# EAGLE design DOT-SHIM (EAGLE 9.6.2)
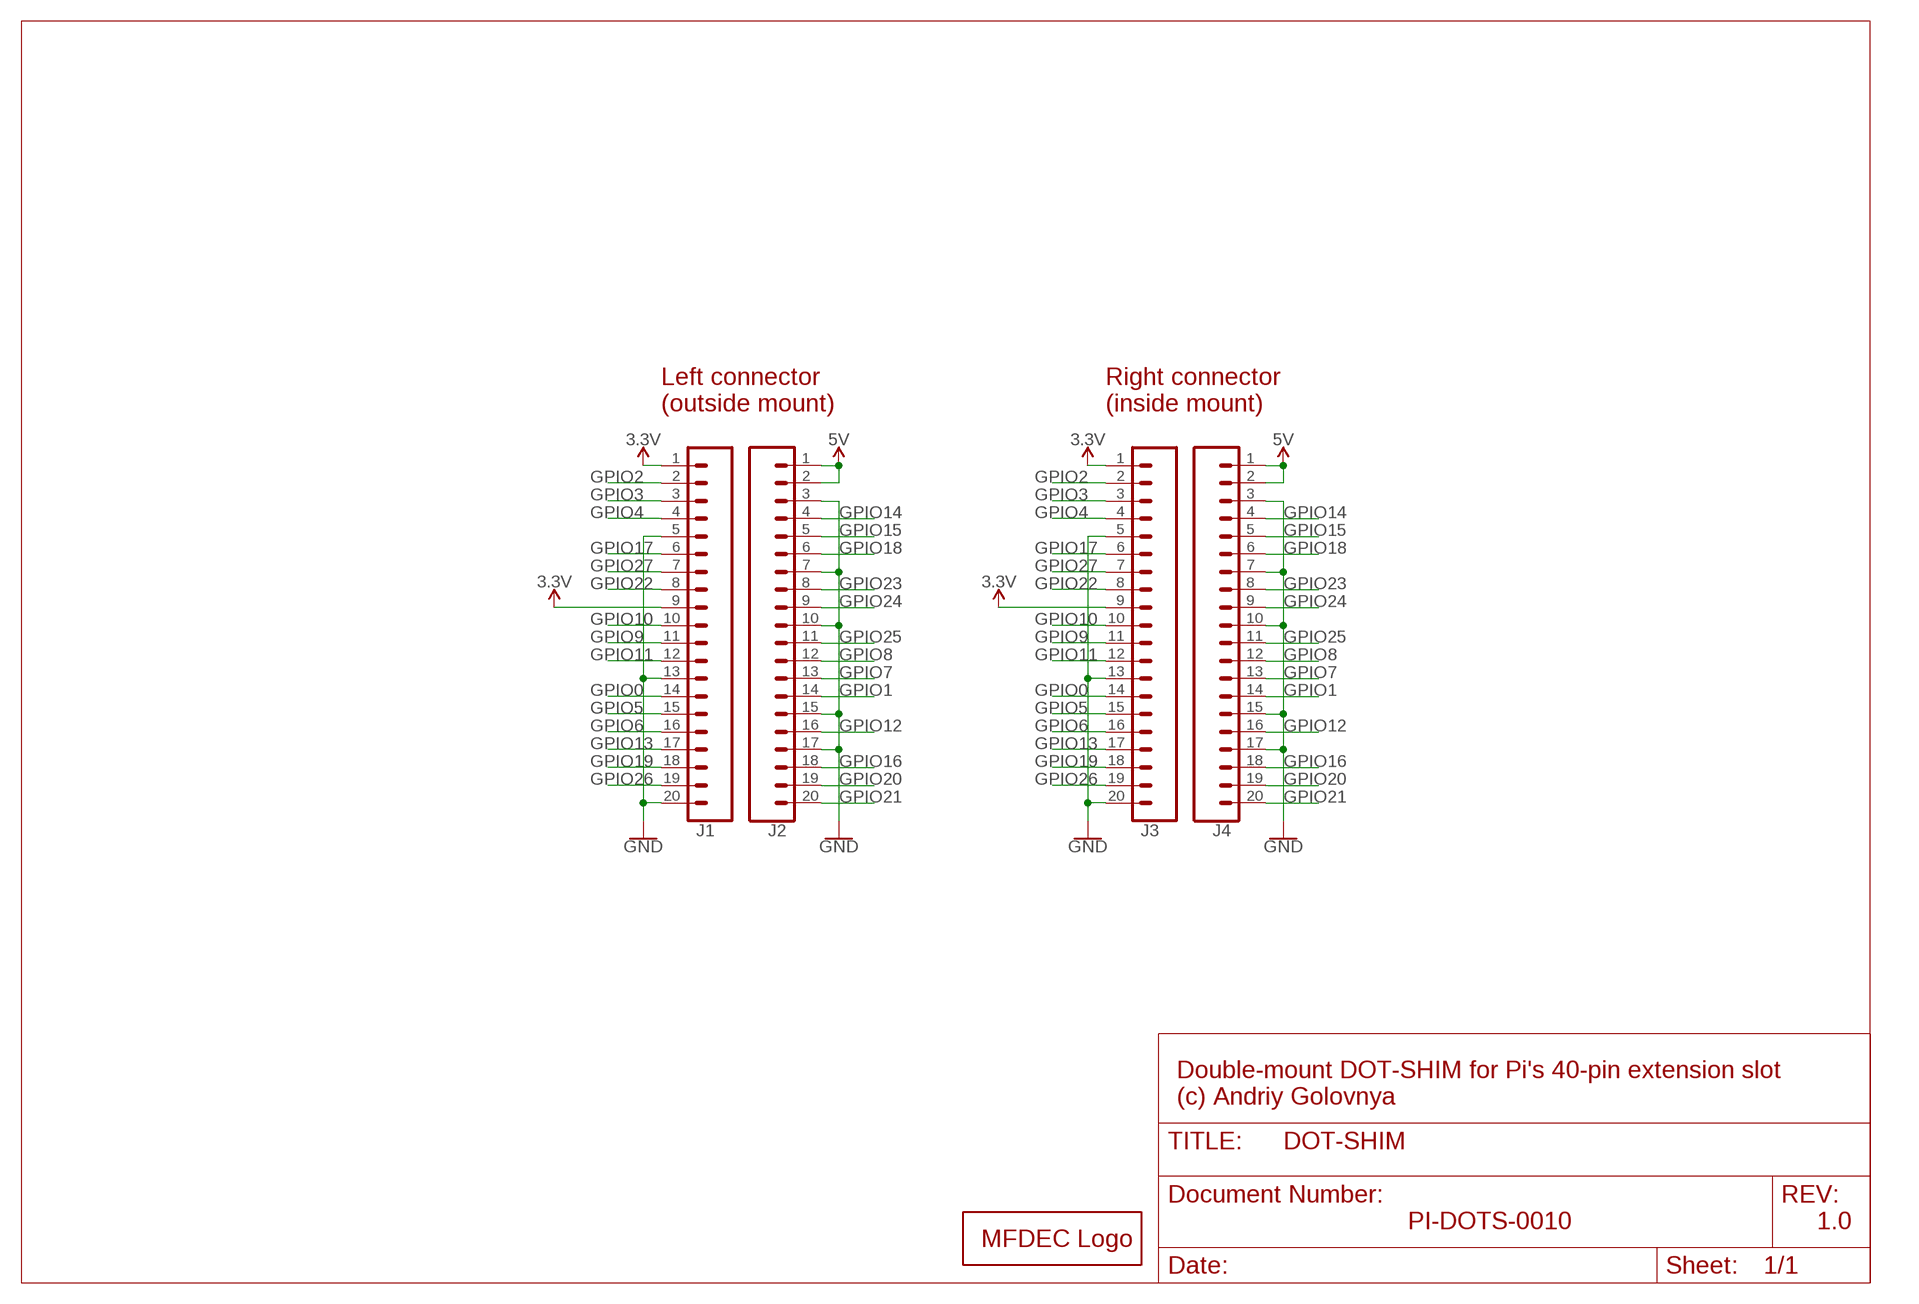
[diagram p0: schematic, sheet 1]

## Parts
J1  CONN_20LOCK  [1X20_LOCK]
J2  CONN_20LOCK  [1X20_LOCK]
J3  CONN_20LOCK  [1X20_LOCK]
J4  CONN_20LOCK  [1X20_LOCK]
LOGO2  MFDECLOGO_L_20MM  [MFDEC_L_20MM]

## Nets
3.3V: J1.1 J1.9 J3.1 J3.9
5V: J2.1 J2.2 J4.1 J4.2
GND: J1.5 J1.13 J1.20 J2.3 J2.7 J2.10 J2.15 J2.17 J3.5 J3.13 J3.20 J4.3 J4.7 J4.10 J4.15 J4.17
GPIO0: J1.14 J3.14
GPIO1: J2.14 J4.14
GPIO2: J1.2 J3.2
GPIO3: J1.3 J3.3
GPIO4: J1.4 J3.4
GPIO5: J1.15 J3.15
GPIO6: J1.16 J3.16
GPIO7: J2.13 J4.13
GPIO8: J2.12 J4.12
GPIO9: J1.11 J3.11
GPIO10: J1.10 J3.10
GPIO11: J1.12 J3.12
GPIO12: J2.16 J4.16
GPIO13: J1.17 J3.17
GPIO14: J2.4 J4.4
GPIO15: J2.5 J4.5
GPIO16: J2.18 J4.18
GPIO17: J1.6 J3.6
GPIO18: J2.6 J4.6
GPIO19: J1.18 J3.18
GPIO20: J2.19 J4.19
GPIO21: J2.20 J4.20
GPIO22: J1.8 J3.8
GPIO23: J2.8 J4.8
GPIO24: J2.9 J4.9
GPIO25: J2.11 J4.11
GPIO26: J1.19 J3.19
GPIO27: J1.7 J3.7

## Notes on the sheet
- Left connector
  (outside mount)
- Right connector
  (inside mount)
- Double-mount DOT-SHIM for Pi's 40-pin extension slot
  (c) Andriy Golovnya
- PI-DOTS-0010 | 1.0

## Library data of the parts
J1-J4 = _my_locked_connectors:CONN_20: Multi connection point. Often used as Generic Header-pin footprint for 0.1 inch spaced/style header connections On any of the 0.1 inch spaced packages, you can populate with these: Break Away Headers - Straight <https://www.sparkfun.com/products/116> (PRT-00116) Break Away Male Headers - Right Angle <https://www.sparkfun.com/products/553> (PRT-00553) Female Headers <https://www.sparkfun.com/products/115> (PRT-00115) Break Away Headers - Machine Pin <https://www.sparkfun.com/products/117> (PRT-00117) Break Away Female Headers - Swiss Machine Pin <https://www.sparkfun.com/products/743> (PRT-00743) For SCREWTERMINALS and SPRING TERMINALS visit here: Screw Terimnals on SparkFun.com <https://www.sparkfun.com/search/results?term=Screw+Terminals> (5mm/3.5mm/2.54mm spacing) This device is also useful as a general connection point to wire up your design to another part of your project. Our various solder wires solder well into these plated through hole pads. Hook-Up Wire - Assortment (Stranded, 22 AWG) <https://www.sparkfun.com/products/11375> (PRT-11375) Hook-Up Wire - Assortment (Solid Core, 22 AWG) <https://www.sparkfun.com/products/11367> (PRT-11367) View the entire wire category on our website here <https://www.sparkfun.com/categories/141> Special notes: Molex polarized connector foot print use with SKU : PRT-08231 with associated crimp pins and housings. 1MM SMD Version SKU: PRT-10208 NOTES ON THE VARIANTS LOCK and LOCK_LONGPADS... This footprint was designed to help hold the alignment of a through-hole component (i.e. 6-pin header) while soldering it into place. You may notice that each hole has been shifted either up or down by 0.005 of an inch from it's more standard position (which is a perfectly straight line). This slight alteration caused the pins (the squares in the middle) to touch the edges of the holes. Because they are alternating, it causes a "brace" to hold the component in place. 0.005 has proven to be the perfect amount of "off-center" position when using our standard breakaway headers. Although looks a little odd when you look at the bare footprint, once you have a header in there, the alteration is very hard to notice. Also,if you push a header all the way into place, it is covered up entirely on the bottom side. Note about LOCK SPECIAL package: This is just like the LOCK variant in that the holes are staggared by 5 mil, but except for the last two holes. They are not altered from the "standard" footprint layout. This is used for a special purpose on the layout of our Graphic LCD Backpack. Make sure you want to use this device before selecting it for you project!
LOGO2 = _my_logos:MFDECLOGO: Midnight Fog - Digital Eye Candy LOGO

## Board
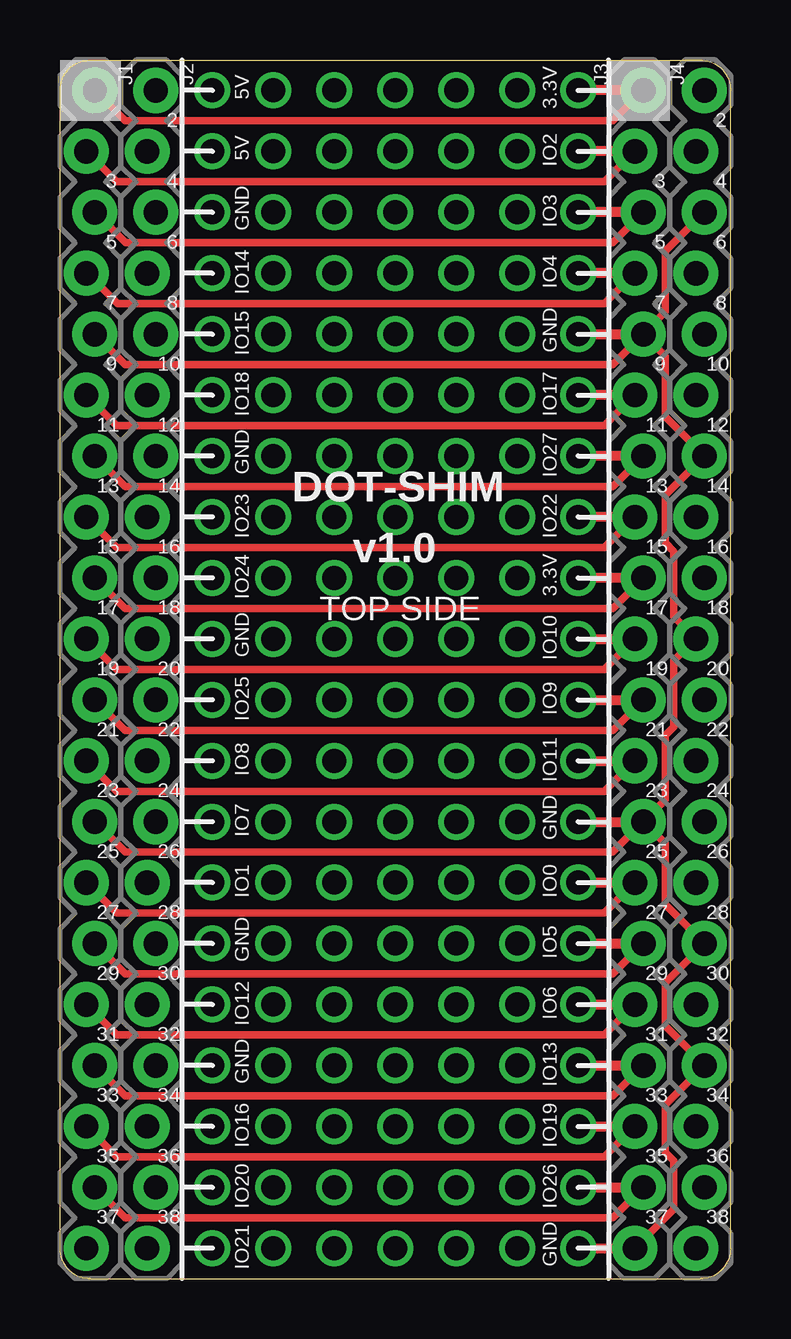
[diagram p1: board, top side]
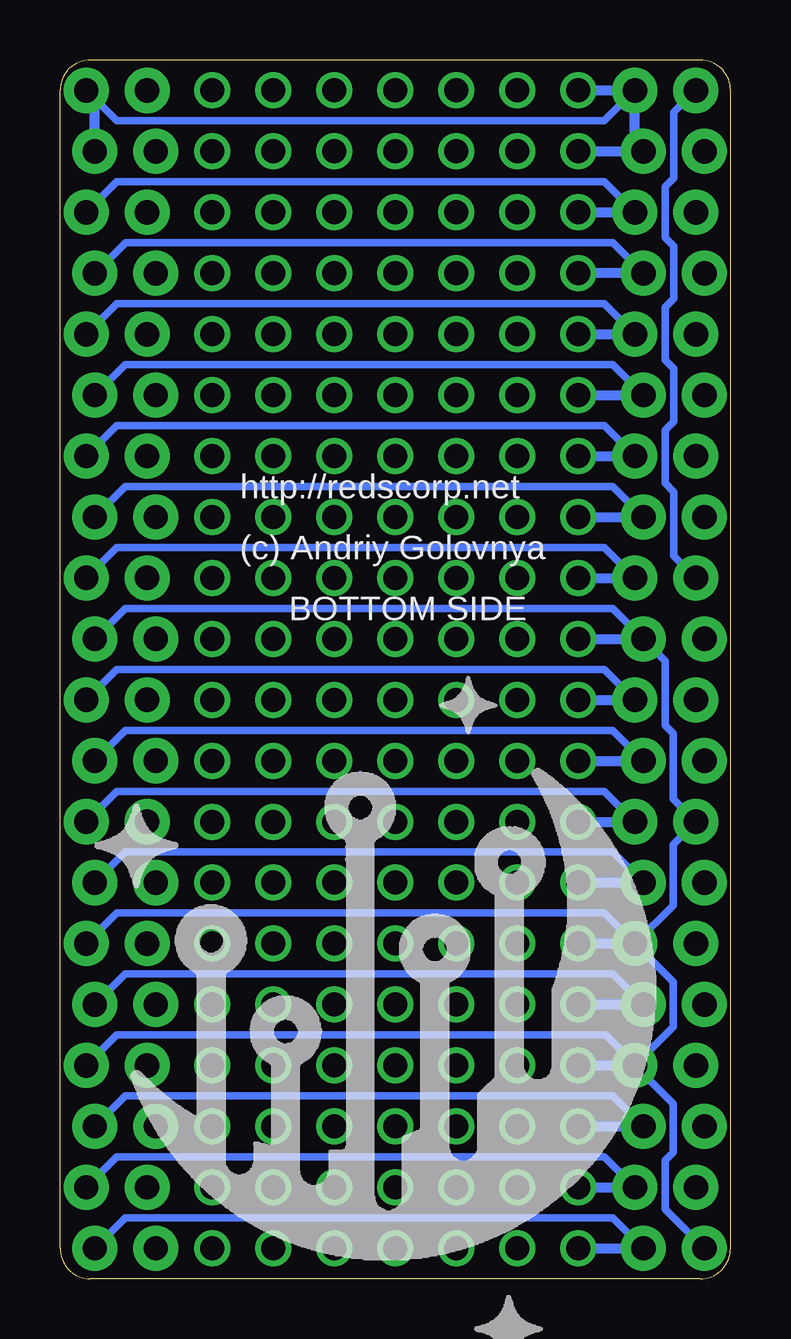
[diagram p2: board, bottom side, seen from below]

Size 27.94 x 50.8 mm. Coordinates in mm from the lower left corner, seen from the top.
Outline: 1.27,0 26.67,0 arc90 27.94,1.27 27.94,49.53 arc90 26.67,50.8 1.27,50.8 arc90 0,49.53 0,1.27 arc90 1.27,0
Copper layers (1*16): Top 0.035mm / dielectric 1.5mm / Bottom 0.035mm
Design rules "default *": minimum track width 6mil, minimum drill 0.35mm, track to track 6mil, track to pad 6mil, pad to pad 6mil, via to via 6mil, smd to smd 6mil, copper to edge 6mil, drill to drill 6mil, minimum pad ring 10mil, minimum via ring 8mil, stop-mask expansion 4mil, vias tented up to drill 20mil, thermal gap 10mil

### Footprints (pad centres in the part's own frame; a part is rotated, then mirrored left to right if it is on the bottom)
1X20_LOCK = drill 1.016 pad 1.88: 1 0,0.178; 2 2.54,-0.178; 3 5.08,0.178; 4 7.62,-0.178; 5 10.16,0.178; 6 12.7,-0.178; 7 15.24,0.178; 8 17.78,-0.178; 9 20.32,0.178; 10 22.86,-0.178; 11 25.4,0.178; 12 27.94,-0.178; 13 30.48,0.178; 14 33.02,-0.178; 15 35.56,0.178; 16 38.1,-0.178; 17 40.64,0.178; 18 43.18,-0.178; 19 45.72,0.178; 20 48.26,-0.178

### Placement (x,y rotation side)
J1  1.27,49.53 270 top
J2  3.81,49.53 270 top
J3  24.13,49.53 270 top
J4  26.67,49.53 270 top
LOGO2  1.27,-5.08 90 bottom  (outside the outline)

### Tracks (layer width: path | path; a pad name or v marks a point on that pad's centre or on a via)
3.3V  (via drill 1)
  Top 0.305: J1.1 2.72,48.26 23.04,48.26 J3.1 | J1.9 2.72,27.94 23.04,27.94 J3.9
  Top 0.406: J3.1 v21.59,49.53 | J3.9 v21.59,29.21
  Bottom 0.305: J1.1 2.36,48.62 2.36,45.88 2.72,45.52 2.72,43.39 2.36,43.03 2.36,40.85 2.72,40.49 2.72,38.28 2.36,37.93 2.36,35.72 2.72,35.36 2.72,33.16 2.36,32.8 2.36,30.12 J1.9
5V  (via drill 1)
  Bottom 0.305: J4.1 25.58,48.26 5.26,48.26 J2.1
  Bottom 0.406: v6.35,49.53 J2.1 3.99,47.35 J2.2 v6.35,46.99 | J4.2 26.49,49.17 J4.1
GND  (via drill 1)
  Top 0.305: J1.5 2.72,38.1 23.04,38.1 J3.5 | J1.13 2.72,17.78 23.04,17.78 J3.13 | J3.20 25.58,2.9 25.58,4.92 25.22,5.28 25.22,7.25 26.85,8.87 J4.17 26.85,8.91 25.22,10.53 25.22,12.33 26.85,13.95 J4.15 25.22,15.6 25.22,18.14 J3.13 | J3.13 25.22,19.96 25.22,22.64 25.58,23 25.58,25.76 J4.10 26.49,26.69 25.58,27.6 25.58,30.32 25.22,30.68 25.22,32.66 J4.7 26.85,34.31 25.22,35.93 25.22,38.46 J3.5 | J3.5 24.31,39.39 25.22,40.3 25.22,42.82 J4.3
  Top 0.406: v21.59,39.37 J3.5 | v21.59,19.05 J3.13 | v21.59,1.27 J3.20
  Bottom 0.305: J4.3 25.58,45.72 5.26,45.72 J2.3 | J1.20 2.72,2.9 2.72,4.95 2.39,5.28 2.39,7.29 J2.17 | J2.17 2.39,10.49 2.39,12.37 J2.15 5.26,15.24 25.58,15.24 J4.15 | 3.96,13.99 2.39,15.57 2.39,18.11 J1.13 2.39,19.99 2.39,22.73 2.72,23.06 2.72,25.76 J2.10 4.9,27.94 25.22,27.94 J4.10 | J2.7 5.26,35.56 25.58,35.56 J4.7 | J2.17 3.99,8.94 5.21,10.16 25.58,10.16 J4.17
  Bottom 0.406: v6.35,44.45 J2.3 | v6.35,34.29 J2.7 | v6.35,26.67 J2.10 | v6.35,13.97 J2.15 3.96,13.99 | v6.35,8.89 J2.17
GPIO0  (via drill 1)
  Top 0.305: J1.14 2.36,15.24 22.68,15.24 J3.14
  Top 0.406: v21.59,16.51 J3.14
GPIO1  (via drill 1)
  Bottom 0.305: J2.14 4.9,17.78 25.22,17.78 J4.14
  Bottom 0.406: v6.35,16.51 J2.14
GPIO2  (via drill 1)
  Top 0.305: J1.2 2.36,45.72 22.68,45.72 J3.2
  Top 0.406: J3.2 v21.59,46.99
GPIO3  (via drill 1)
  Top 0.305: J1.3 1.47,44.45 2.74,43.18 23.04,43.18 J3.3
  Top 0.406: J3.3 v21.59,44.45
GPIO4  (via drill 1)
  Top 0.305: J1.4 1.14,41.91 2.41,40.64 22.68,40.64 J3.4
  Top 0.406: J3.4 v21.59,41.91
GPIO5  (via drill 1)
  Top 0.305: J1.15 2.72,12.7 23.04,12.7 J3.15
  Top 0.406: v21.59,13.97 J3.15
GPIO6  (via drill 1)
  Top 0.305: J1.16 2.36,10.16 22.68,10.16 J3.16
  Top 0.406: v21.59,11.43 J3.16
GPIO7  (via drill 1)
  Bottom 0.305: J2.13 5.26,20.32 25.58,20.32 J4.13
  Bottom 0.406: v6.35,19.05 J2.13
GPIO8  (via drill 1)
  Bottom 0.305: J2.12 4.9,22.86 25.22,22.86 J4.12
  Bottom 0.406: v6.35,21.59 J2.12
GPIO9  (via drill 1)
  Top 0.305: J1.11 2.72,22.86 23.04,22.86 J3.11
  Top 0.406: v21.59,24.13 J3.11
GPIO10  (via drill 1)
  Top 0.305: J1.10 2.36,25.4 22.68,25.4 J3.10
  Top 0.406: v21.59,26.67 J3.10
GPIO11  (via drill 1)
  Top 0.305: J1.12 2.36,20.32 22.68,20.32 J3.12
  Top 0.406: v21.59,21.59 J3.12
GPIO12  (via drill 1)
  Bottom 0.305: J2.16 4.9,12.7 25.22,12.7 J4.16
  Bottom 0.406: v6.35,11.43 J2.16
GPIO13  (via drill 1)
  Top 0.305: J1.17 2.72,7.62 23.04,7.62 J3.17
  Top 0.406: v21.59,8.89 J3.17
GPIO14  (via drill 1)
  Bottom 0.305: J2.4 4.9,43.18 25.2,43.18 26.47,41.91 J4.4
  Bottom 0.406: J2.4 v6.35,41.91
GPIO15  (via drill 1)
  Bottom 0.305: J2.5 5.26,40.64 25.58,40.64 J4.5
  Bottom 0.406: v6.35,39.37 J2.5
GPIO16  (via drill 1)
  Bottom 0.305: J2.18 4.9,7.62 25.22,7.62 J4.18
  Bottom 0.406: v6.35,6.35 J2.18
GPIO17  (via drill 1)
  Top 0.305: J1.6 2.36,35.56 22.68,35.56 J3.6
  Top 0.406: J3.6 v21.59,36.83
GPIO18  (via drill 1)
  Bottom 0.305: J2.6 4.9,38.1 25.22,38.1 J4.6
  Bottom 0.406: v6.35,36.83 J2.6
GPIO19  (via drill 1)
  Top 0.305: J1.18 2.36,5.08 22.68,5.08 J3.18
  Top 0.406: v21.59,6.35 J3.18
GPIO20  (via drill 1)
  Bottom 0.305: J2.19 5.26,5.08 25.58,5.08 J4.19
  Bottom 0.406: v6.35,3.81 J2.19
GPIO21  (via drill 1)
  Bottom 0.305: J2.20 4.9,2.54 25.22,2.54 J4.20
  Bottom 0.406: v6.35,1.27 J2.20
GPIO22  (via drill 1)
  Top 0.305: J1.8 2.36,30.48 22.68,30.48 J3.8
  Top 0.406: J3.8 v21.59,31.75
GPIO23  (via drill 1)
  Bottom 0.305: J2.8 4.9,33.02 25.22,33.02 J4.8
  Bottom 0.406: v6.35,31.75 J2.8
GPIO24  (via drill 1)
  Bottom 0.305: J2.9 5.26,30.48 25.58,30.48 J4.9
  Bottom 0.406: v6.35,29.21 J2.9
GPIO25  (via drill 1)
  Bottom 0.305: J2.11 5.26,25.4 25.58,25.4 J4.11
  Bottom 0.406: v6.35,24.13 J2.11
GPIO26  (via drill 1)
  Top 0.305: J1.19 2.72,2.54 23.04,2.54 J3.19
  Top 0.406: v21.59,3.81 J3.19
GPIO27  (via drill 1)
  Top 0.305: J1.7 2.72,33.02 23.04,33.02 J3.7
  Top 0.406: J3.7 v21.59,34.29
N$2  (via drill 1)
  other vias: 8.89,1.27
N$3  (via drill 1)
  other vias: 11.43,1.27
N$4  (via drill 1)
  other vias: 13.97,1.27
N$5  (via drill 1)
  other vias: 16.51,1.27
N$6  (via drill 1)
  other vias: 19.05,1.27
N$9  (via drill 1)
  other vias: 19.05,3.81
N$10  (via drill 1)
  other vias: 16.51,3.81
N$11  (via drill 1)
  other vias: 13.97,3.81
N$12  (via drill 1)
  other vias: 11.43,3.81
N$13  (via drill 1)
  other vias: 8.89,3.81
N$16  (via drill 1)
  other vias: 8.89,6.35
N$17  (via drill 1)
  other vias: 11.43,6.35
N$18  (via drill 1)
  other vias: 13.97,6.35
N$19  (via drill 1)
  other vias: 16.51,6.35
N$20  (via drill 1)
  other vias: 19.05,6.35
N$23  (via drill 1)
  other vias: 19.05,8.89
N$24  (via drill 1)
  other vias: 16.51,8.89
N$25  (via drill 1)
  other vias: 13.97,8.89
N$26  (via drill 1)
  other vias: 11.43,8.89
N$27  (via drill 1)
  other vias: 8.89,8.89
N$30  (via drill 1)
  other vias: 8.89,11.43
N$31  (via drill 1)
  other vias: 11.43,11.43
N$32  (via drill 1)
  other vias: 13.97,11.43
N$33  (via drill 1)
  other vias: 16.51,11.43
N$34  (via drill 1)
  other vias: 19.05,11.43
N$37  (via drill 1)
  other vias: 19.05,13.97
N$38  (via drill 1)
  other vias: 16.51,13.97
N$39  (via drill 1)
  other vias: 13.97,13.97
N$40  (via drill 1)
  other vias: 11.43,13.97
N$41  (via drill 1)
  other vias: 8.89,13.97
N$44  (via drill 1)
  other vias: 8.89,16.51
N$45  (via drill 1)
  other vias: 11.43,16.51
N$46  (via drill 1)
  other vias: 13.97,16.51
N$47  (via drill 1)
  other vias: 16.51,16.51
N$48  (via drill 1)
  other vias: 19.05,16.51
N$51  (via drill 1)
  other vias: 19.05,19.05
N$52  (via drill 1)
  other vias: 16.51,19.05
N$53  (via drill 1)
  other vias: 13.97,19.05
N$54  (via drill 1)
  other vias: 11.43,19.05
N$55  (via drill 1)
  other vias: 8.89,19.05
N$58  (via drill 1)
  other vias: 8.89,21.59
N$59  (via drill 1)
  other vias: 11.43,21.59
N$60  (via drill 1)
  other vias: 13.97,21.59
N$61  (via drill 1)
  other vias: 16.51,21.59
N$62  (via drill 1)
  other vias: 19.05,21.59
N$65  (via drill 1)
  other vias: 19.05,24.13
N$66  (via drill 1)
  other vias: 16.51,24.13
N$67  (via drill 1)
  other vias: 13.97,24.13
N$68  (via drill 1)
  other vias: 11.43,24.13
N$69  (via drill 1)
  other vias: 8.89,24.13
N$72  (via drill 1)
  other vias: 8.89,26.67
N$73  (via drill 1)
  other vias: 11.43,26.67
N$74  (via drill 1)
  other vias: 13.97,26.67
N$75  (via drill 1)
  other vias: 16.51,26.67
N$76  (via drill 1)
  other vias: 19.05,26.67
N$79  (via drill 1)
  other vias: 19.05,29.21
N$80  (via drill 1)
  other vias: 16.51,29.21
N$81  (via drill 1)
  other vias: 13.97,29.21
N$82  (via drill 1)
  other vias: 11.43,29.21
N$83  (via drill 1)
  other vias: 8.89,29.21
N$86  (via drill 1)
  other vias: 8.89,31.75
N$87  (via drill 1)
  other vias: 11.43,31.75
N$88  (via drill 1)
  other vias: 13.97,31.75
N$89  (via drill 1)
  other vias: 16.51,31.75
N$90  (via drill 1)
  other vias: 19.05,31.75
N$93  (via drill 1)
  other vias: 19.05,34.29
N$94  (via drill 1)
  other vias: 16.51,34.29
N$95  (via drill 1)
  other vias: 13.97,34.29
N$96  (via drill 1)
  other vias: 11.43,34.29
N$97  (via drill 1)
  other vias: 8.89,34.29
N$100  (via drill 1)
  other vias: 8.89,36.83
N$101  (via drill 1)
  other vias: 11.43,36.83
N$102  (via drill 1)
  other vias: 13.97,36.83
N$103  (via drill 1)
  other vias: 16.51,36.83
N$104  (via drill 1)
  other vias: 19.05,36.83
N$107  (via drill 1)
  other vias: 19.05,39.37
N$108  (via drill 1)
  other vias: 16.51,39.37
N$109  (via drill 1)
  other vias: 13.97,39.37
N$110  (via drill 1)
  other vias: 11.43,39.37
N$111  (via drill 1)
  other vias: 8.89,39.37
N$114  (via drill 1)
  other vias: 8.89,41.91
N$115  (via drill 1)
  other vias: 11.43,41.91
N$116  (via drill 1)
  other vias: 13.97,41.91
N$117  (via drill 1)
  other vias: 16.51,41.91
N$118  (via drill 1)
  other vias: 19.05,41.91
N$121  (via drill 1)
  other vias: 19.05,44.45
N$122  (via drill 1)
  other vias: 16.51,44.45
N$123  (via drill 1)
  other vias: 13.97,44.45
N$124  (via drill 1)
  other vias: 11.43,44.45
N$125  (via drill 1)
  other vias: 8.89,44.45
N$128  (via drill 1)
  other vias: 8.89,46.99
N$129  (via drill 1)
  other vias: 11.43,46.99
N$130  (via drill 1)
  other vias: 13.97,46.99
N$131  (via drill 1)
  other vias: 16.51,46.99
N$132  (via drill 1)
  other vias: 19.05,46.99
N$135  (via drill 1)
  other vias: 19.05,49.53
N$136  (via drill 1)
  other vias: 16.51,49.53
N$137  (via drill 1)
  other vias: 13.97,49.53
N$138  (via drill 1)
  other vias: 11.43,49.53
N$139  (via drill 1)
  other vias: 8.89,49.53

### Text on the board
tPlace: 5V | 3.3V | 2 | 2 | 5V | IO2 | 3 | 4 | 3 | 4 | GND | IO3 | 5 | 6 | 5 | 6 | IO14 | IO4 | 7 | 8 | 7 | 8 | GND | 9 | 10 | IO15 | 9 | 10 | IO18 | IO17 | 11 | 12 | 11 | 12 | GND | 13 | 14 | IO27 | 13 | 14 | DOT-SHIM | IO23 | IO22 | 15 | 16 | v1.0 | 15 | 16 | 17 | 18 | IO24 | 3.3V | 17 | 18 | TOP SIDE | GND | IO10 | 19 | 20 | 19 | 20 | 21 | 22 | IO25 | IO9 | 21 | 22 | IO8 | IO11 | 23 | 24 | 23 | 24 | 25 | 26 | IO7 | GND | 25 | 26 | IO1 | IO0 | 27 | 28 | 27 | 28 | GND | IO5 | 29 | 30 | 29 | 30 | IO12 | IO6 | 31 | 32 | 31 | 32 | GND | IO13 | 33 | 34 | 33 | 34 | 35 | 36 | IO16 | IO19 | 35 | 36 | IO20 | IO26 | 37 | 38 | 37 | 38 | GND | IO21
bPlace: http://redscorp.net | (c) Andriy Golovnya | BOTTOM SIDE